# EAGLE design BrewMonitorEagle (EAGLE 6.5.0)
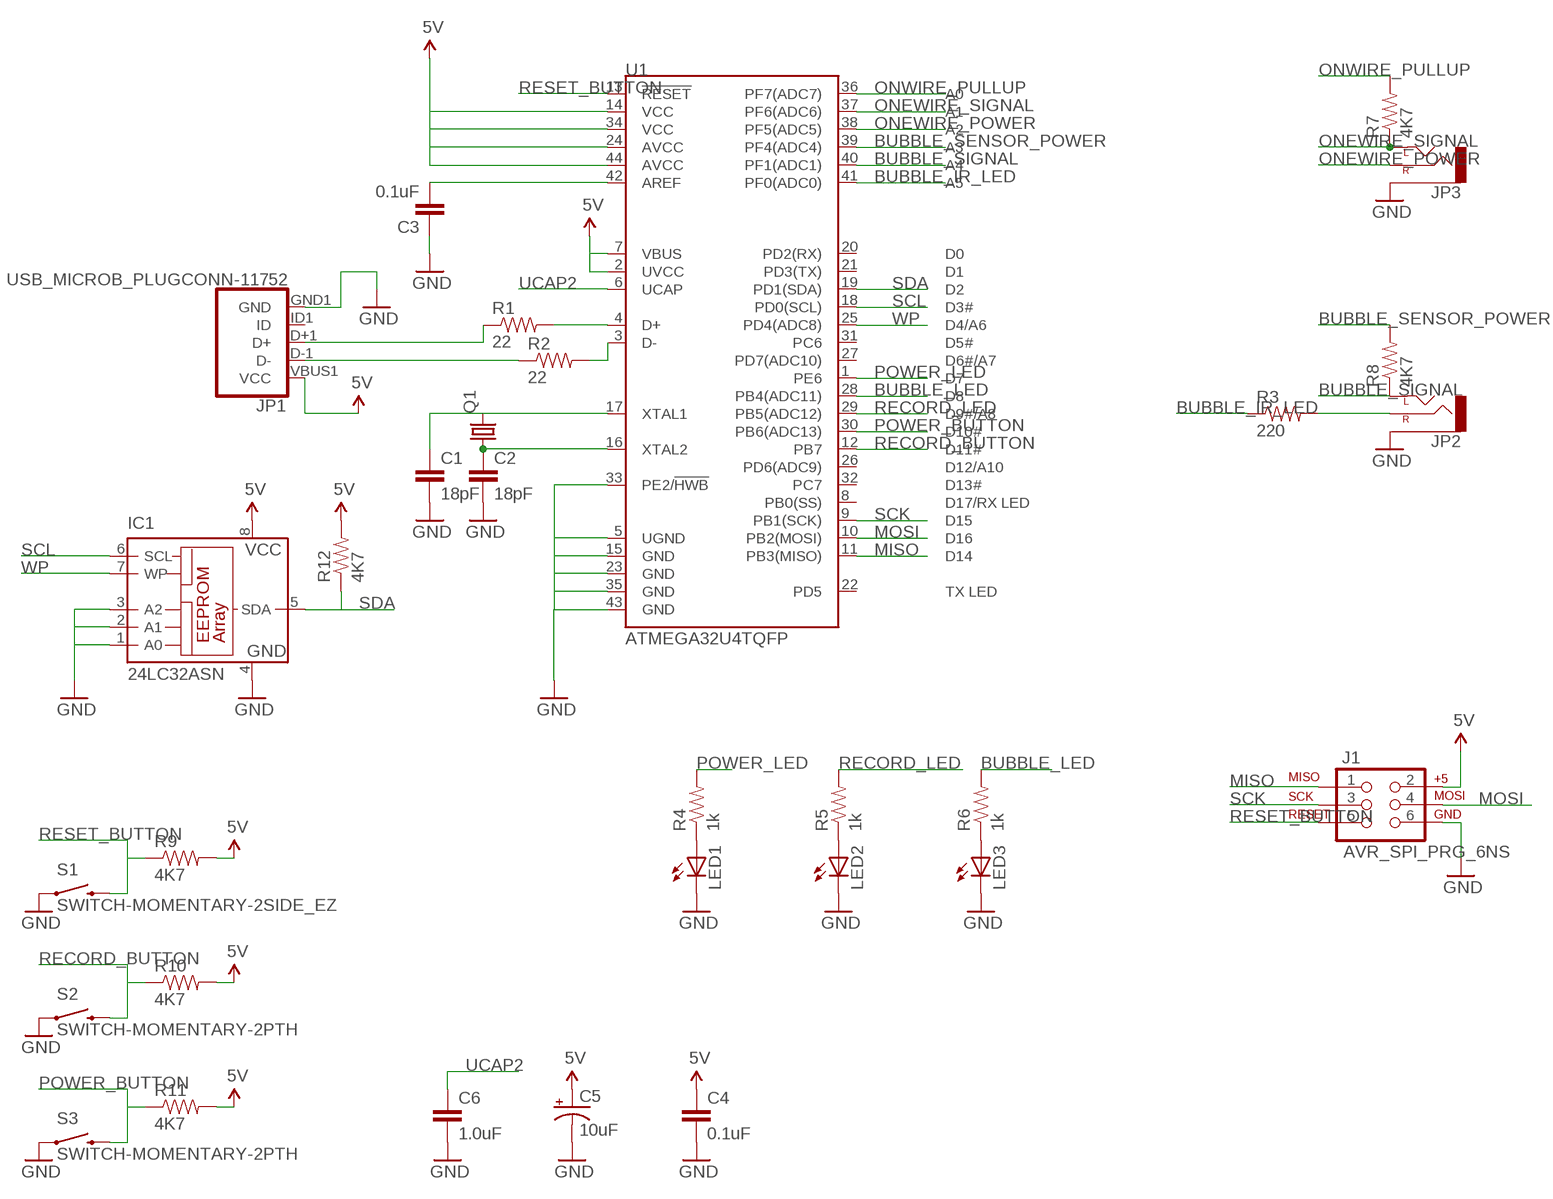
[diagram p0: schematic, sheet 1]

## Parts
C1  18pF  18PF-50V-5%(0603)  [0603-CAP]
C2  18pF  18PF-50V-5%(0603)  [0603-CAP]
C3  0.1uF  0.1UF-25V(+80/-20%)(0603)  [0603-CAP]
C4  0.1uF  0.1UF-25V(+80/-20%)(0603)  [0603-CAP]
C5  10uF  10UF-16V-10%(TANT)  [EIA3216]
C6  1.0uF  1.0UF-16V-10%(0603)  [0603-CAP]
IC1  24LC32ASN  [SO-08]
J1  AVR_SPI_PRG_6NS  [2X3-NS]
JP1  USB_MICROB_PLUGCONN-11752  [USB-B-MICRO-SMD_V03]
JP2  AUDIO-JACKSMD2  [AUDIO-JACK-3.5MM-SMD]
JP3  AUDIO-JACKSMD2  [AUDIO-JACK-3.5MM-SMD]
LED1  LED-3MM-NO_SILK  [LED3MM-NS]
LED2  LED-3MM-NO_SILK  [LED3MM-NS]
LED3  LED-3MM-NO_SILK  [LED3MM-NS]
Q1  CRYSTALHC49UP  [HC49UP]
R1  22  22OHM1/10W1%(0603)  [0603-RES]
R2  22  22OHM1/10W1%(0603)  [0603-RES]
R3  220  220-5%  [0603-RES]
R4  1k  1K-1%  [0603-RES]
R5  1k  1K-1%  [0603-RES]
R6  1k  1K-1%  [0603-RES]
R7  4K7  4.7KOHM1/10W1%(0603)  [0603]
R8  4K7  4.7KOHM1/10W1%(0603)  [0603]
R9  4K7  4.7KOHM1/10W1%(0603)  [0603]
R10  4K7  4.7KOHM1/10W1%(0603)  [0603]
R11  4K7  4.7KOHM1/10W1%(0603)  [0603]
R12  4K7  4.7KOHM1/10W1%(0603)  [0603]
S1  SWITCH-MOMENTARY-2SIDE_EZ  [TACTILE-PTH-SIDEEZ]
S2  SWITCH-MOMENTARY-2PTH  [TACTILE-PTH]
S3  SWITCH-MOMENTARY-2PTH  [TACTILE-PTH]
U1  ATMEGA32U4TQFP  [SPARKFUN-DIGITALIC_TQFP44]

## Nets
5V: C4.1 C5.A(+) IC1.8(VCC) J1.2 JP1.VBUS1(VCC) R9.2 R10.2 R11.2 R12.2 U1.2(UVCC) U1.7(VBUS) U1.14(VCC) U1.24(AVCC) U1.34(VCC) U1.44(AVCC)
BUBBLE_IR_LED: R3.1 U1.41(PF0(ADC0))
BUBBLE_LED: R6.2 U1.28(PB4(ADC11))
BUBBLE_SENSOR_POWER: R8.2 U1.39(PF4(ADC4))
BUBBLE_SIGNAL: JP2.TIP(LEFT) R8.1 U1.40(PF1(ADC1))
GND: C1.2 C2.2 C3.1 C4.2 C5.C(-) C6.2 IC1.1(A0) IC1.2(A1) IC1.3(A2) IC1.4(GND) J1.6 JP1.GND1(GND) JP2.SLEEVE JP3.SLEEVE LED1.K(C) LED2.K(C) LED3.K(C) S1.1 S2.1 S3.1 U1.5(UGND) U1.15(GND) U1.23(GND) U1.33(PE2/!HWB) U1.35(GND) U1.43(GND)
MISO: J1.1 U1.11(PB3(MISO))
MOSI: J1.4 U1.10(PB2(MOSI))
N$1: R2.2 U1.3(D-)
N$2: R1.2 U1.4(D+)
N$3: C1.1 Q1.2 U1.17(XTAL1)
N$4: C2.1 Q1.1 U1.16(XTAL2)
N$6: JP1.D-1(D-) R2.1
N$7: JP1.D+1(D+) R1.1
N$8: C3.2 U1.42(AREF)
N$9: LED1.A R4.1
N$10: LED2.A R5.1
N$11: LED3.A R6.1
N$14: JP2.RING(RIGHT) R3.2
ONEWIRE_POWER: JP3.RING(RIGHT) U1.38(PF5(ADC5))
ONEWIRE_SIGNAL: JP3.TIP(LEFT) R7.1 U1.37(PF6(ADC6))
ONWIRE_PULLUP: R7.2 U1.36(PF7(ADC7))
POWER_BUTTON: R11.1 S3.3 U1.30(PB6(ADC13))
POWER_LED: R4.2 U1.1(PE6)
RECORD_BUTTON: R10.1 S2.3 U1.12(PB7)
RECORD_LED: R5.2 U1.29(PB5(ADC12))
RESET_BUTTON: J1.5 R9.1 S1.2 U1.13(!RESET)
SCK: J1.3 U1.9(PB1(SCK))
SCL: IC1.6(SCL) U1.18(PD0(SCL))
SDA: IC1.5(SDA) R12.1 U1.19(PD1(SDA))
UCAP2: C6.1 U1.6(UCAP)
WP: IC1.7(WP) U1.25(PD4(ADC8))
Unconnected: JP1.ID1(ID) U1.8(PB0(SS)) U1.20(PD2(RX)) U1.21(PD3(TX)) U1.22(PD5) U1.26(PD6(ADC9)) U1.27(PD7(ADC10)) U1.31(PC6) U1.32(PC7)

## Library data of the parts
C1 C2 = SparkFun-Capacitors:18PF-50V-5%(0603): CAP-08267; PROD_ID: CAP-08267
C3 C4 = SparkFun-Capacitors:0.1UF-25V(+80/-20%)(0603): CAP-00810 Ceramic Standard decoupling cap; PROD_ID: CAP-00810
C5 = SparkFun-Capacitors:10UF-16V-10%(TANT): CAP-00811 1206/EIA-3216 Tantalum capacitor; PROD_ID: CAP-00811
C6 = SparkFun-Capacitors:1.0UF-16V-10%(0603): CAP-00868; PROD_ID: CAP-00868
IC1 = microchip:24*: Serial EEPROM I2C; MF: MICROCHIP; MPN: 24LC32A/SN; OC_FARNELL: 9758003; OC_NEWARK: 33C2976
J1 = SparkFun-Connectors:AVR_SPI_PRG_6: AVR ISP 6 Pin This is the reduced ISP connector for AVR programming. Common on Arduino. This footprint will take up less PCB space and can be used with a 10-pin to 6-pin adapter such as SKU: BOB-08508
JP1 = SparkFun-Connectors:USB_MICROB_PLUG: USB Micro-B Plug Comes in a variety of packages. Check out Hirose's ZX-x0 line: http://www.hirose.co.jp/cataloge_hp/e24200011.pdf; PROD_ID: CONN-11752
JP2 JP3 = SparkFun-Connectors:AUDIO-JACK: 3.5mm Audio Jack Simple 3.5mm common PCB mount audio jack. SKU: PRT-08032; PROD_ID: CONN-10353
LED1-LED3 = SparkFun-LED:LED: LEDs Standard schematic elements and footprints for 5mm, 3mm, 1206, and 0603 sized LEDs. 5mm - Spark Fun Electronics SKU : COM-00529 (and others)
Q1 = adafruit:CRYSTAL: CRYSTAL; OC_FARNELL: unknown; OC_NEWARK: unknown
R1 R2 = SparkFun-Resistors:22OHM1/10W1%(0603): RES-08698; PROD_ID: RES-08698
R3 = SparkFun-Resistors:220-5%: 220-ohm SMT 1/8W - 5% (0805) RES-07866; PROD_ID: RES-07866
R4-R6 = SparkFun-Resistors:1K-1%: 1k-ohm SMT 1/10W - 1% (0603) RES-07856; PROD_ID: RES-07856
R7-R12 = SparkFun-Resistors:4.7KOHM1/10W1%(0603): RES-07857; PROD_ID: RES-07857
S1-S3 = SparkFun-Electromechanical:SWITCH-MOMENTARY-2: Various NO switches- pushbuttons, reed, etc
U1 = SparkFun-DigitalIC:ATMEGA32U4: Atmel 44-pin 8-bit Microcontroller with 32KBytes of ISP Flash and USB Controller ----- Please use the QFN-44-NOPAD_1:1 package for the footprint of all boards using a 32U4. Route traces directly away from the pads as much as possible.; PROD_ID: IC-11161

## Board
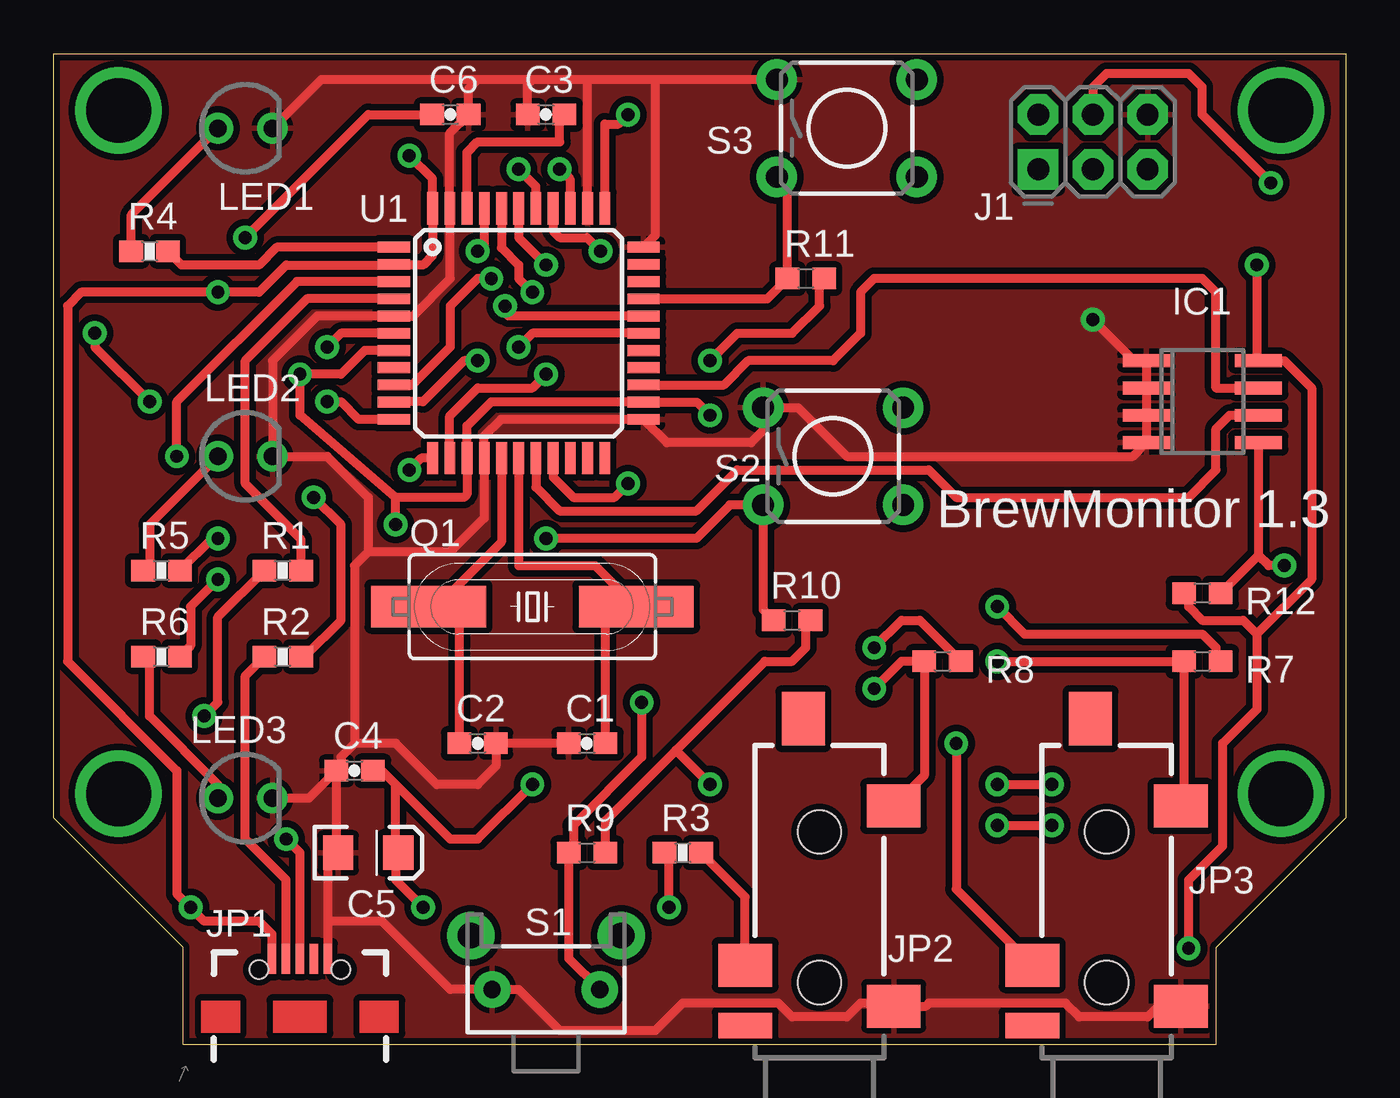
[diagram p1: board, top side]
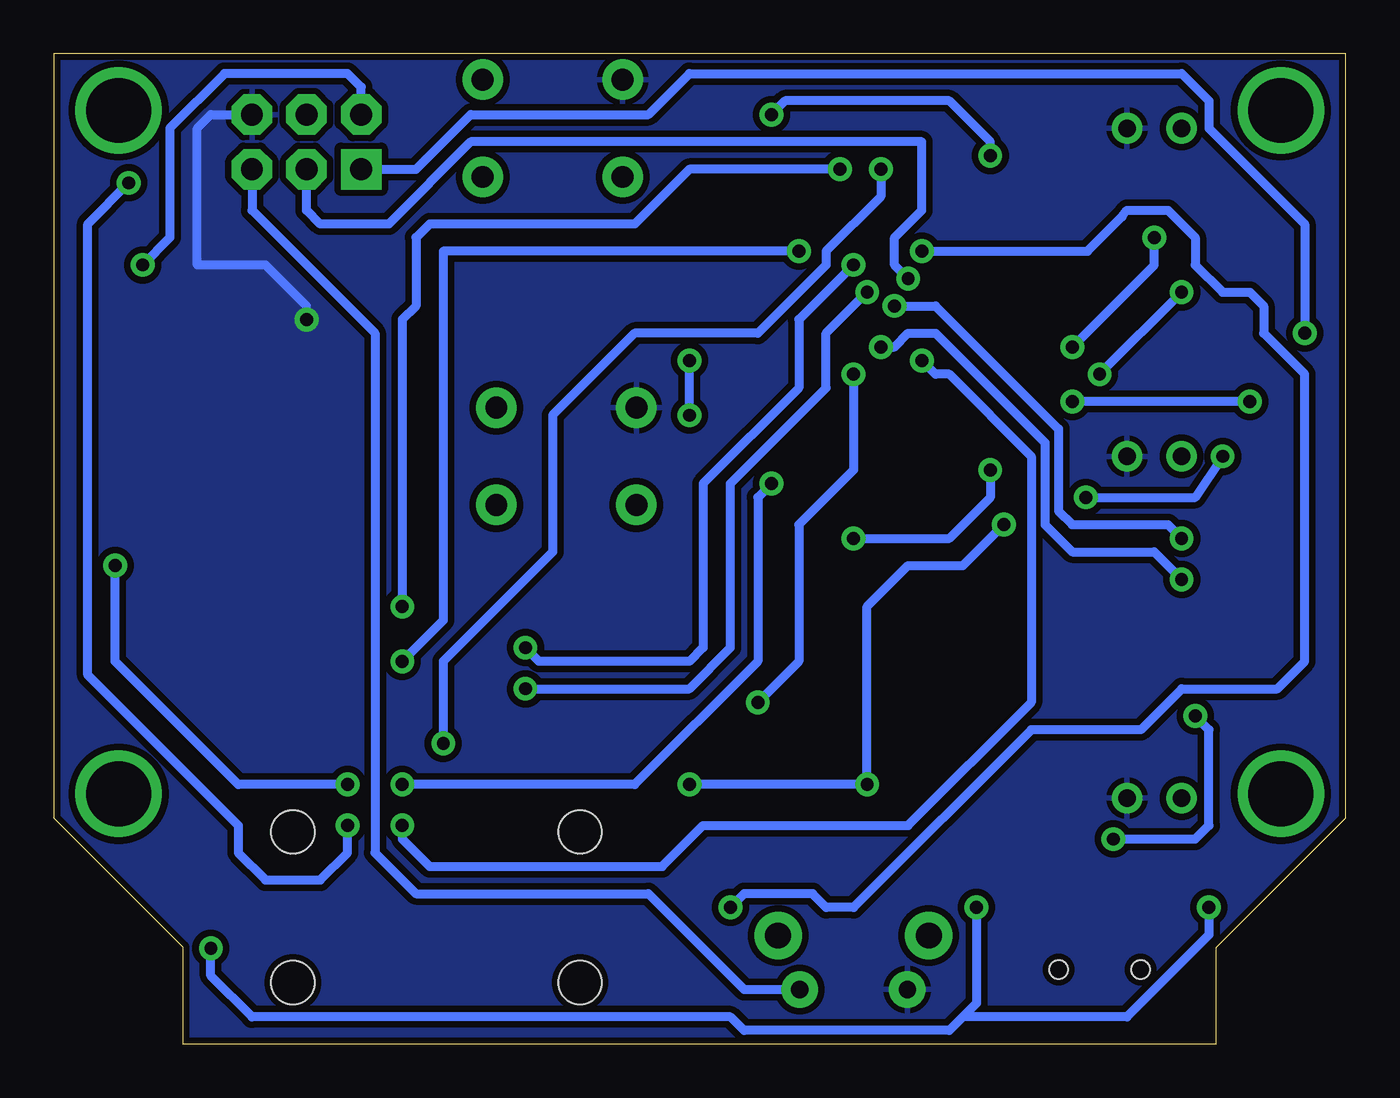
[diagram p2: board, bottom side, seen from below]

Size 60 x 46 mm. Coordinates in mm from the lower left corner, seen from the top.
Outline: 6,0 54,0 54,4.5 60,10.5 60,46 0,46 0,10.5 6,4.5 6,0
Copper layers (1*16): Top 0.035mm / dielectric 1.5mm / Bottom 0.035mm
Design rules "SparkFun": minimum track width 8mil, minimum drill 20mil, track to track 8mil, track to pad 8mil, pad to pad 8mil, via to via 8mil, smd to smd 8mil, copper to edge 8mil, drill to drill 8mil, minimum pad ring 12mil, minimum via ring 10mil, stop-mask expansion 4mil, vias tented up to drill 20mil, thermal gap 10mil

### Footprints (pad centres in the part's own frame; a part is rotated, then mirrored left to right if it is on the bottom)
0603-CAP = smd 1.1 x 1: 1 -0.85,0; 2 0.85,0
EIA3216 = smd 1.4 x 1.6: A 1.4,0; C -1.4,0
SO-08 = smd 0.6 x 2.2: 1 -1.905,-2.6; 2 -0.635,-2.6; 3 0.635,-2.6; 4 1.905,-2.6; 5 1.905,2.6; 6 0.635,2.6; 7 -0.635,2.6; 8 -1.905,2.6
2X3-NS = drill 1.016 pad 1.88 square: 1 -2.54,-1.27 | drill 1.016 pad 1.88 octagon: 2 -2.54,1.27; 3 0,-1.27; 4 0,1.27; 5 2.54,-1.27; 6 2.54,1.27
USB-B-MICRO-SMD_V03 = smd 1.4 x 0.4: D+1 2.7,0; D-1 2.7,0.65; GND1 2.7,-1.3; ID1 2.7,-0.65; VBUS1 2.7,1.3 | hole 0.85: 2.2,1.9; 2.2,-1.9
AUDIO-JACK-3.5MM-SMD = smd 2 x 2.5: RING 4.3,3.45; SLEEVE 2.4,-3.45; TIP 11.7,-3.45 | smd 1.2 x 2.5: RSH 1.5,3.45 | smd 2.5 x 2: TSH 15.75,0.75 | hole 2: 3.5,0; 10.5,0
LED3MM-NS = drill 0.813: A -1.27,0; K 1.27,0
HC49UP = smd 5.334 x 1.93: 1 -4.826,0; 2 4.826,0
0603-RES = smd 1.1 x 1: 1 -0.85,0; 2 0.85,0
0603 = smd 1.1 x 1: 1 -0.85,0; 2 0.85,0
TACTILE-PTH-SIDEEZ = drill 0.8 pad 1.7: 1 -2.5,0; 2 2.5,0 | drill 1.2 pad 2.2: ANCHOR1 -3.5,2.5; ANCHOR2 3.5,2.5
TACTILE-PTH = drill 1.016 pad 1.88: 1 -3.251,2.261; 2 3.251,2.261; 3 -3.251,-2.261; 4 3.251,-2.261
SPARKFUN-DIGITALIC_TQFP44 = smd 1.5 x 0.5: 1 -5.8,4; 2 -5.8,3.2; 3 -5.8,2.4; 4 -5.8,1.6; 5 -5.8,0.8; 6 -5.8,0; 7 -5.8,-0.8; 8 -5.8,-1.6; 9 -5.8,-2.4; 10 -5.8,-3.2; 11 -5.8,-4; 23 5.8,-4; 24 5.8,-3.2; 25 5.8,-2.4; 26 5.8,-1.6; 27 5.8,-0.8; 28 5.8,0; 29 5.8,0.8; 30 5.8,1.6; 31 5.8,2.4; 32 5.8,3.2; 33 5.8,4 | smd 0.5 x 1.5: 12 -4,-5.8; 13 -3.2,-5.8; 14 -2.4,-5.8; 15 -1.6,-5.8; 16 -0.8,-5.8; 17 0,-5.8; 18 0.8,-5.8; 19 1.6,-5.8; 20 2.4,-5.8; 21 3.2,-5.8; 22 4,-5.8; 34 4,5.8; 35 3.2,5.8; 36 2.4,5.8; 37 1.6,5.8; 38 0.8,5.8; 39 0,5.8; 40 -0.8,5.8; 41 -1.6,5.8; 42 -2.4,5.8; 43 -3.2,5.8; 44 -4,5.8

### Placement (x,y rotation side)
C1  24.77,13.97 180 top
C2  19.68,13.97 0 top
C3  22.86,43.18 0 top
C4  13.97,12.7 180 top
C5  14.61,8.89 0 top
C6  18.41,43.18 0 top
IC1  53.34,29.84 270 top
J1  48.26,41.91 0 top
JP1  11.43,1.27 90 top
JP2  35.56,-0.64 90 top
JP3  48.9,-0.64 90 top
LED1  8.89,42.55 0 top
LED2  8.89,27.3 0 top
LED3  8.89,11.43 0 top
Q1  22.23,20.32 0 top
R1  10.63,22 0 top
R2  10.63,18 0 top
R3  29.21,8.89 0 top
R4  4.45,36.83 0 top
R5  5,22 0 top
R6  5,18 0 top
R7  53.34,17.78 0 top
R8  41.27,17.78 0 top
R9  24.77,8.89 0 top
R10  34.29,19.68 0 top
R11  34.92,35.56 0 top
R12  53.34,20.95 180 top
S1  22.86,2.54 0 top
S2  36.2,27.3 0 top
S3  36.83,42.55 0 top
U1  21.59,33.02 0 top

### Tracks (layer width: path | path; a pad name or v marks a point on that pad's centre or on a via)
5V  (via drill 0.6)
  Top 0.406: C5.A 15.88,8.89 | 15.88,8.89 15.88,12.06 | 15.88,12.06 15.24,12.7 C4.1 | v52.7,4.45 52.7,7.62 54.29,9.21 54.29,13.97 55.88,15.56 55.88,19.05 | 52.7,20.95 R12.2 52.7,20.74 52.7,20.32 53.34,19.68 55.24,19.68 55.88,19.05 | 55.88,19.05 58.42,21.59 58.42,30.48 57.15,31.75 IC1.8 55.88,31.81 v55.88,36.2 | 15.88,8.89 15.88,7.62 v17.14,6.35 | 15.88,25.4 19.05,25.4 19.19,25.54 U1.14 19.19,28.71 20.32,29.84 27.36,29.84 U1.24 29.87,29.82 v30.48,29.21 | 15.88,25.4 11.43,29.21 v11.43,31.11 13.34,31.11 14.44,32.22 U1.7 | 15.88,12.06 18.41,9.53 19.68,9.53 v22.23,12.06 | v15.88,24.13 15.88,25.4 | U1.34 25.59,42.73 26.23,42.73 v26.67,43.18 | v16.51,41.27 17.59,40.2 U1.44 17.59,36.64 17.14,36.2 15.81,36.2 U1.2 15.77,36.2 10.79,36.2 9.53,34.92 v7.62,34.92 1.27,34.92 0.64,34.29 0.64,17.78 5.71,12.7 5.71,6.99 v6.35,6.35 6.99,5.71 9.53,5.71 10.13,5.11 JP1.VBUS1 | R9.2 25.61,10.38 28.89,13.65 | 28.89,13.65 33.02,17.78 34.29,17.78 34.92,18.41 34.92,19.47 R10.2 | v30.48,31.75 31.75,33.02 34.29,33.02 35.56,34.29 35.56,35.34 R11.2 | v30.48,12.06 28.89,13.65
  Bottom 0.406: v6.35,6.35 6.35,5.08 10.16,1.27 17.78,1.27 | 17.78,1.27 18.41,0.64 27.94,0.64 28.57,1.27 50.8,1.27 52.7,3.17 v52.7,4.45 | v17.14,6.35 17.14,1.91 17.78,1.27 | J1.2 45.72,44.45 46.35,45.09 52.07,45.09 54.61,42.55 54.61,37.47 v55.88,36.2 | v11.43,31.11 v7.62,34.92 | v15.88,24.13 17.78,22.23 20.32,22.23 22.23,20.32 v22.23,12.06 v30.48,12.06 | v16.51,41.27 16.51,41.91 18.41,43.81 26.04,43.81 v26.67,43.18 | v30.48,29.21 v30.48,31.75
BUBBLE_IR_LED  (via drill 0.6)
  Top 0.406: U1.41 19.99,37.13 v19.68,36.83 | v28.57,6.35 28.57,8.68 R3.1
  Bottom 0.406: v28.57,6.35 27.94,6.99 24.77,6.99 24.13,6.35 22.86,6.35 14.61,14.61 9.53,14.61 7.62,16.51 3.17,16.51 1.91,17.78 1.91,31.11 3.81,33.02 3.81,34.29 4.45,34.92 5.71,34.92 6.99,36.2 6.99,37.47 8.26,38.73 10.16,38.73 10.39,38.43 11.99,36.83 v19.68,36.83
BUBBLE_LED  (via drill 0.6)
  Top 0.406: v7.62,21.59 6.35,20.32 6.35,18.5 R6.2 | U1.28 22.23,33.02 v21.59,32.38
  Bottom 0.406: v7.62,21.59 8.89,22.86 12.7,22.86 13.97,24.13 13.97,27.94 19.05,33.02 20.32,33.02 20.95,32.38 v21.59,32.38
BUBBLE_SENSOR_POWER  (via drill 0.6)
  Top 0.406: U1.39 21.59,37.47 v22.86,36.2 | v38.1,18.41 39.37,19.68 40.22,19.68 R8.2
  Bottom 0.406: v22.86,36.2 25.4,33.66 25.4,30.48 29.84,26.04 29.84,18.41 30.48,17.78 37.47,17.78 v38.1,18.41
BUBBLE_SIGNAL  (via drill 0.6)
  Top 0.406: JP2.TIP 40.42,12.48 R8.1 39.37,17.78 v38.1,16.51 | U1.40 20.79,36.99 21.59,36.2 21.59,35.56 v22.23,34.92
  Bottom 0.406: v38.1,16.51 30.48,16.51 28.57,18.41 28.57,26.04 24.13,30.48 24.13,33.02 v22.23,34.92
GND  (via drill 0.6)
  Top 0.406: S3.1 27.94,44.81 | 27.94,44.81 24.77,44.81 | 24.77,44.81 22.23,44.81 | 22.23,44.81 19.68,44.81 | 19.68,44.81 12.42,44.81 LED1.K | 19.68,44.81 19.27,44.39 C6.2 18.39,42.3 U1.43 18.41,38.8 18.41,35.56 16.68,33.82 U1.5 12.23,33.82 10.16,31.75 LED2.K 12.7,27.3 14.61,25.4 14.61,22.86 | C3.1 22.01,44.59 22.23,44.81 | U1.35 24.79,44.78 24.77,44.81 | 24.13,13.97 C1.2 C2.2 | 20.32,14.19 C2.2 | C2.2 20.54,12.91 19.68,12.06 17.78,12.06 15.88,13.97 13.97,13.97 | 13.97,13.97 13.34,13.34 13.34,12.91 C4.2 | C4.2 13.12,8.97 C5.C 12.73,8.41 12.73,5.71 | JP3.SLEEVE 52.2,1.91 51.44,1.91 50.8,1.27 47.62,1.27 46.99,1.91 40.64,1.91 40.5,1.76 JP2.SLEEVE 38.87,1.91 37.47,1.91 36.83,1.27 34.29,1.27 33.66,1.91 29.21,1.91 27.94,0.64 23.5,0.64 21.59,2.54 S1.1 18.41,2.54 15.24,5.71 12.73,5.71 | LED3.K 11.85,11.43 C4.2 | 14.61,22.86 18.41,22.86 19.99,24.43 U1.15 19.99,28.25 20.77,29.02 U1.23 28.47,27.94 32.38,27.94 32.94,28.5 S2.1 34.57,29.57 36.83,27.3 50.1,27.3 IC1.4 IC1.3 IC1.2 IC1.1 50.16,31.75 v48.26,33.66 | 14.61,22.86 13.97,22.23 13.97,13.97 | U1.33 27.94,37.57 27.94,44.81 | JP1.GND1 12.73,5.71
  Bottom 0.406: v48.26,33.66 48.26,34.29 50.16,36.2 53.34,36.2 53.34,42.55 52.7,43.18 J1.6
  pour Top (isolate 0.305): 0,46 60,46 60,10.5 54,4.5 54,0 6,0 6,4.5 0,10.5
  pour Bottom (isolate 0.305): 0,46 60,46 60,10.5 54,4.5 54,0 6,0 6,4.5 0,10.5
MISO  (via drill 0.6)
  Top 0.406: v1.91,33.02 1.91,32.38 v4.45,29.84 | v12.7,29.84 13.34,29.84 14.16,29.02 U1.11
  Bottom 0.406: J1.1 43.18,40.64 40.64,43.18 32.38,43.18 30.48,45.09 7.62,45.09 6.35,43.81 6.35,42.55 1.91,38.1 v1.91,33.02 | v4.45,29.84 v12.7,29.84
MOSI  (via drill 0.6)
  Top 0.406: v43.81,10.16 v46.35,10.16 | v56.52,40.01 53.34,43.18 53.34,44.45 52.7,45.09 48.9,45.09 48.26,44.45 J1.4 | v19.68,31.75 19.05,31.75 17.14,29.84 15.81,29.84 U1.10
  Bottom 0.406: v56.52,40.01 58.42,38.1 58.42,17.14 51.44,10.16 51.44,8.89 50.16,7.62 47.62,7.62 46.35,8.89 v46.35,10.16 | v19.68,31.75 19.05,31.11 18.41,31.11 14.61,27.3 14.61,15.88 20.32,10.16 29.84,10.16 31.75,8.26 42.55,8.26 43.81,9.53 v43.81,10.16
N$1  (via drill 0.6)
  Top 0.406: R2.2 11.65,18 13.34,19.68 13.34,24.13 v12.06,25.4 | v5.71,27.3 5.71,29.84 11.29,35.42 U1.3
  Bottom 0.406: v12.06,25.4 6.99,25.4 v5.71,27.3
N$2
  Top 0.406: R1.2 11.48,23.44 8.89,26.04 8.89,31.75 11.76,34.62 U1.4
N$3
  Top 0.406: C1.1 25.61,19.52 Q1.2 25.15,22.23 21.59,22.23 U1.17
N$4
  Top 0.406: C2.1 18.84,19.52 17.91,20.45 | 17.91,20.45 Q1.1 | U1.16 20.79,23.33 17.91,20.45
N$5  (via drill 3)
  other vias: 3.01,43.38
N$6
  Top 0.406: JP1.D-1 10.78,7.63 8.89,9.53 8.89,17.11 R2.1
N$7  (via drill 0.6)
  Top 0.406: JP1.D+1 11.43,8.89 v10.79,9.53 | v6.99,15.24 7.62,15.88 7.62,19.84 R1.1
  Bottom 0.406: v10.79,9.53 6.99,9.53 6.35,10.16 6.35,14.61 v6.99,15.24
N$8
  Top 0.406: U1.42 19.19,41.41 19.68,41.91 23.5,41.91 23.5,42.97 C3.2
N$9
  Top 0.406: R4.1 3.6,38.52 LED1.A
N$10
  Top 0.406: LED2.A 4.45,24.13 4.45,22.3 R5.1
N$11
  Top 0.406: LED3.A 7.62,12.06 4.45,15.24 4.45,17.7 R6.1
N$12  (via drill 3)
  other vias: 3.01,11.62
N$13  (via drill 3)
  other vias: 56.99,11.62
N$14
  Top 0.406: JP2.RING 32.11,6.84 R3.2
N$15  (via drill 3)
  other vias: 56.99,43.38
N$17
  pour Top (isolate 0.305): 0,46 60,46 60,10.5 54,4.5 54,0 6,0 6,4.5 0,10.5
ONEWIRE_POWER  (via drill 0.6)
  Top 0.406: U1.38 22.39,39.84 v21.59,40.64 | v41.91,13.97 41.91,7.2 JP3.RING
  Bottom 0.406: v21.59,40.64 21.59,39.37 24.13,36.83 24.13,36.2 27.3,33.02 33.02,33.02 36.83,29.21 36.83,22.86 41.91,17.78 v41.91,13.97
ONEWIRE_SIGNAL  (via drill 0.6)
  Top 0.406: JP3.TIP 52.49,11.21 R7.1 v43.81,17.78 | U1.37 23.19,37.77 23.5,37.47 24.77,37.47 v25.4,36.83
  Bottom 0.406: v25.4,36.83 41.91,36.83 41.91,19.68 v43.81,17.78
ONWIRE_PULLUP  (via drill 0.6)
  Top 0.406: U1.36 23.99,40.15 v23.5,40.64 | v43.81,20.32 45.09,19.05 53.34,19.05 53.98,18.41 53.98,18 R7.2 53.98,17.78
  Bottom 0.406: v23.5,40.64 30.48,40.64 33.02,38.1 42.55,38.1 43.18,37.47 43.18,34.29 43.81,33.66 v43.81,20.32
POWER_BUTTON
  Top 0.406: U1.30 33.13,34.62 R11.1 34.08,39.79 S3.3
POWER_LED
  Top 0.406: 5.49,37.02 R4.2 5.93,36.2 9.53,36.2 10.35,37.02 U1.1
RECORD_BUTTON  (via drill 0.6)
  Top 0.406: R10.1 32.94,20.18 S2.3 31.39,25.04 29.84,23.5 v22.86,23.5 | U1.12 17.06,27.22 v16.51,26.67
  Bottom 0.406: v22.86,23.5 18.41,23.5 16.51,25.4 v16.51,26.67
RECORD_LED  (via drill 0.6)
  Top 0.406: v7.62,23.5 7.34,23.5 R5.2 | U1.29 21.12,33.82 v20.95,34.29
  Bottom 0.406: v7.62,23.5 8.26,24.13 12.7,24.13 13.34,24.77 13.34,28.57 19.05,34.29 v20.95,34.29
RESET_BUTTON  (via drill 0.6)
  Top 0.406: S1.2 23.91,3.98 R9.1 24.13,9.11 24.13,10.16 27.3,13.34 v27.3,15.88 | U1.13 18.39,29.18 19.68,30.48 22.23,30.48 v22.86,31.11
  Bottom 0.406: J1.5 50.8,38.73 45.09,33.02 45.09,8.89 43.18,6.99 32.38,6.99 27.94,2.54 S1.2 | v22.86,31.11 22.86,26.67 25.4,24.13 25.4,17.78 v27.3,15.88
SCK  (via drill 0.6)
  Top 0.406: U1.9 16.65,30.62 18.41,32.38 18.41,34.29 19.68,35.56 v20.32,35.56
  Bottom 0.406: v20.32,35.56 20.95,36.2 20.95,37.47 19.68,38.73 19.68,41.91 40.64,41.91 44.45,38.1 47.62,38.1 48.26,38.73 J1.3
SCL
  Top 0.406: U1.18 22.39,25.87 23.5,24.77 29.84,24.77 31.75,26.67 40.64,26.67 41.91,25.4 52.7,25.4 53.98,26.67 53.98,28.57 54.61,29.21 IC1.6
SDA  (via drill 0.6)
  Top 0.406: IC1.5 55.94,22.7 | 55.94,22.7 R12.1 | U1.19 23.19,26.34 24.13,25.4 26.04,25.4 v26.67,26.04 | v43.81,12.06 v46.35,12.06 | v57.15,22.23 56.42,22.23 55.94,22.7
  Bottom 0.406: v26.67,26.04 27.3,25.4 27.3,17.78 33.02,12.06 v43.81,12.06 | v46.35,12.06 51.44,12.06 57.15,17.78 v57.15,22.23
UCAP2  (via drill 0.6)
  Top 0.406: U1.6 13.34,33.02 v12.7,32.38 | v8.89,37.47 14.61,43.18 C6.1
  Bottom 0.406: v12.7,32.38 8.89,36.2 v8.89,37.47
WP
  Top 0.406: IC1.7 53.98,30.48 53.98,34.92 53.34,35.56 38.1,35.56 37.47,34.92 37.47,33.02 36.2,31.75 32.24,31.75 31.11,30.62 U1.25

### Text on the board
tPlace: BrewMonitor 1.3
tNames: JP3 | JP2